# EAGLE design attiny4 (EAGLE 7.2.0)
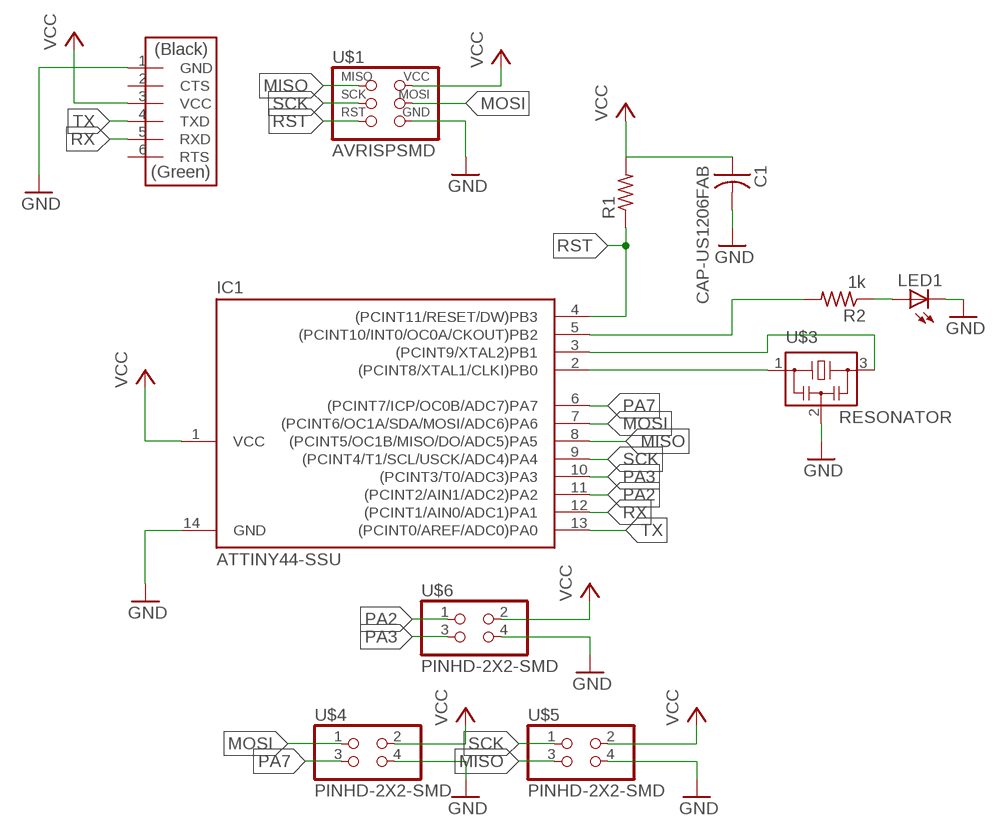
[diagram p0: schematic, sheet 1]

## Parts
C1  CAP-US1206FAB  [C1206FAB]
IC1  ATTINY44-SSU  [SOIC14]
LED1  LEDSML1206  [SML1206]
R1  RES-US1206FAB  [R1206FAB]
R2  1k  RES-US1206FAB  [R1206FAB]
U$1  AVRISPSMD  [2X03SMD]
U$2  FTDI-SMD-HEADER  [1X06SMD]
U$3  RESONATOR  [EFOBM]
U$4  PINHD-2X2-SMD  [2X02SMD]
U$5  PINHD-2X2-SMD  [2X02SMD]
U$6  PINHD-2X2-SMD  [2X02SMD]

## Nets
GND: C1.2 IC1.14(GND) LED1.C U$1.6(GND) U$2.1(GND) U$3.2 U$4.4 U$5.4 U$6.4
MISO: IC1.8((PCINT5/OC1B/MISO/DO/ADC5)PA5) U$1.1(MISO) U$5.3
MOSI: IC1.7((PCINT6/OC1A/SDA/MOSI/ADC6)PA6) U$1.4(MOSI) U$4.1
N$1: LED1.A R2.1
N$15: IC1.3((PCINT9/XTAL2)PB1) U$3.3
N$16: IC1.2((PCINT8/XTAL1/CLKI)PB0) U$3.1
PA2: IC1.11((PCINT2/AIN1/ADC2)PA2) U$6.1
PA3: IC1.10((PCINT3/T0/ADC3)PA3) U$6.3
PA7: IC1.6((PCINT7/ICP/OC0B/ADC7)PA7) U$4.3
PB2: IC1.5((PCINT10/INT0/OC0A/CKOUT)PB2) R2.2
RST: IC1.4((PCINT11/RESET/DW)PB3) R1.1 U$1.5(RST)
RX: IC1.12((PCINT1/AIN0/ADC1)PA1) U$2.5(RXD)
SCK: IC1.9((PCINT4/T1/SCL/USCK/ADC4)PA4) U$1.3(SCK) U$5.1
TX: IC1.13((PCINT0/AREF/ADC0)PA0) U$2.4(TXD)
VCC: C1.1 IC1.1(VCC) R1.2 U$1.2(VCC) U$2.3(VCC) U$4.2 U$5.2 U$6.2
Unconnected: U$2.2(CTS) U$2.6(RTS)

## Library data of the parts
C1 = fab:CAP-US
IC1 = fab:ATTINY44
LED1 = led:LED: LED OSRAM: - CHIPLED LG R971, LG N971, LY N971, LG Q971, LY Q971, LO R971, LY R971 LH N974, LH R974 LS Q976, LO Q976, LY Q976 LO Q996 - Hyper CHIPLED LW Q18S LB Q993, LB Q99A, LB R99A - SideLED LS A670, LO A670, LY A670, LG A670, LP A670 LB A673, LV A673, LT A673, LW A673 LH A674 LY A675 LS A676, LA A676, LO A676, LY A676, LW A676 LS A679, LY A679, LG A679 - Hyper Micro SIDELED® LS Y876, LA Y876, LO Y876, LY Y876 LT Y87S - SmartLED LW L88C, LW L88S LB L89C, LB L89S, LG L890 LS L89K, LO L89K, LY L89K LS L896, LA L896, LO L896, LY L896 - TOPLED LS T670, LO T670, LY T670, LG T670, LP T670 LSG T670, LSP T670, LSY T670, LOP T670, LYG T670 LG T671, LOG T671, LSG T671 LB T673, LV T673, LT T673, LW T673 LH T674 LS T676, LA T676, LO T676, LY T676, LB T676, LH T676, LSB T676, LW T676 LB T67C, LV T67C, LT T67C, LS T67K, LO T67K, LY T67K, LW E67C LS E67B, LA E67B, LO E67B, LY E67B, LB E67C, LV E67C, LT E67C LW T67C LS T679, LY T679, LG T679 LS T770, LO T770, LY T770, LG T770, LP T770 LB T773, LV T773, LT T773, LW T773 LH T774 LS E675, LA E675, LY E675, LS T675 LS T776, LA T776, LO T776, LY T776, LB T776 LHGB T686 LT T68C, LB T68C - Hyper Mini TOPLED® LB M676 - Mini TOPLED Santana® LG M470 LS M47K, LO M47K, LY M47K Source: http://www.osram.convergy.de LUXEON: - LUMILED® LXK2-PW12-R00, LXK2-PW12-S00, LXK2-PW14-U00, LXK2-PW14-V00 LXK2-PM12-R00, LXK2-PM12-S00, LXK2-PM14-U00 LXK2-PE12-Q00, LXK2-PE12-R00, LXK2-PE12-S00, LXK2-PE14-T00, LXK2-PE14-U00 LXK2-PB12-K00, LXK2-PB12-L00, LXK2-PB12-M00, LXK2-PB14-N00, LXK2-PB14-P00, LXK2-PB14-Q00 LXK2-PR12-L00, LXK2-PR12-M00, LXK2-PR14-Q00, LXK2-PR14-R00 LXK2-PD12-Q00, LXK2-PD12-R00, LXK2-PD12-S00 LXK2-PH12-R00, LXK2-PH12-S00 LXK2-PL12-P00, LXK2-PL12-Q00, LXK2-PL12-R00 Source: www.luxeon.com KINGBRIGHT: KA-3528ASYC Source: www.kingbright.com
R1 R2 = fab:RES-US: Resistor (US Symbol) Variants with postfix FAB are widened to allow the routing of internal traces
U$1 = fab:AVRISP
U$2 = fab:FTDI-SMD-HEADER
U$3 = fab:RESONATOR
U$4-U$6 = fab:PINHD-2X2-SMD

## Net classes
0 default: clearance 0.205 mm

## Board
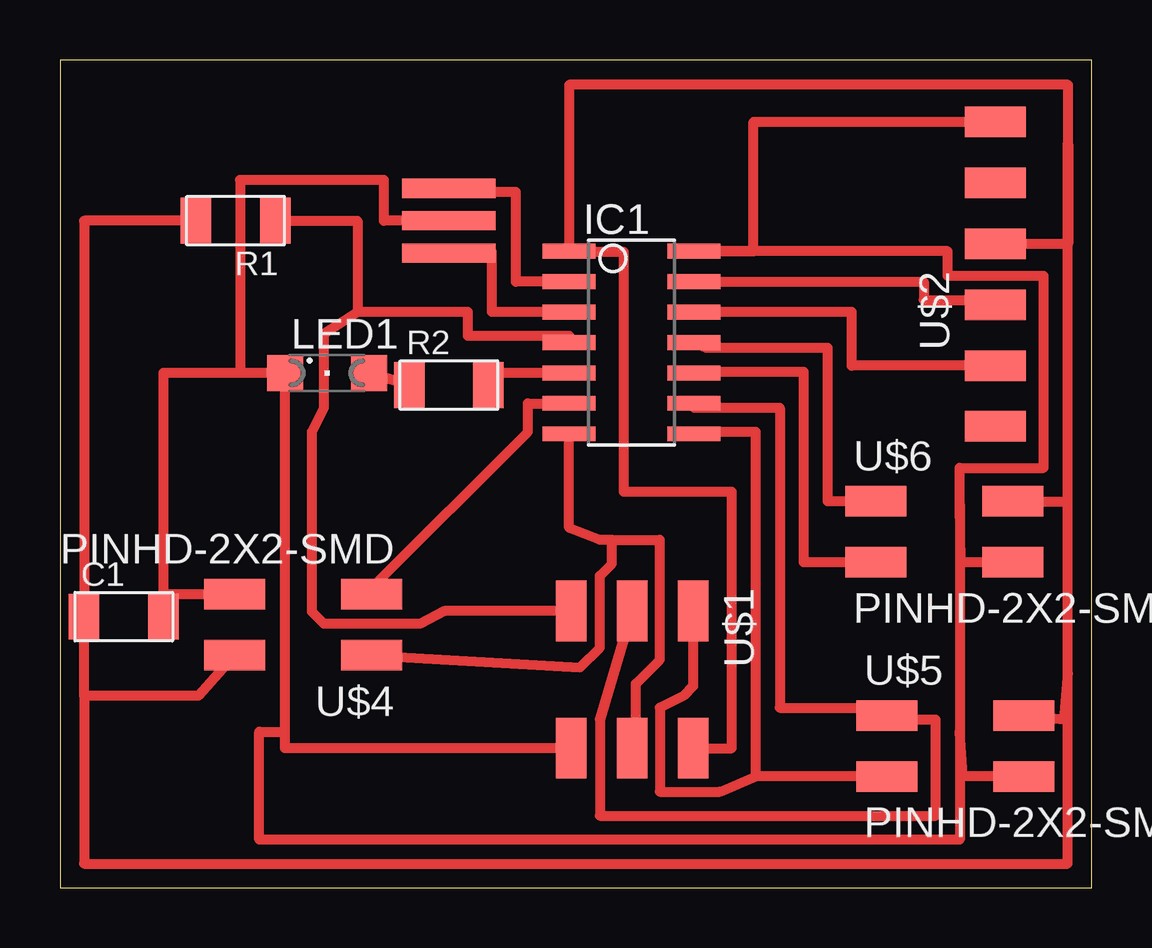
[diagram p1: board, top side]

Size 43 x 34.5 mm. Coordinates in mm from the lower left corner, seen from the top.
Outline: 0,0 43,0 43,34.5 0,34.5 0,0
Copper layers (1*16): Top 0.035mm / dielectric 1.5mm / Bottom 0.035mm
Design rules "default": minimum track width 10mil, minimum drill 24mil, track to track 8mil, track to pad 8mil, pad to pad 8mil, via to via 8mil, smd to smd 8mil, copper to edge 40mil, drill to drill 8mil, minimum pad ring 10mil, minimum via ring 8mil, stop-mask expansion 4mil, vias tented up to drill 0mil, thermal gap 10mil

### Footprints (pad centres in the part's own frame; a part is rotated, then mirrored left to right if it is on the bottom)
C1206FAB = smd 1.27 x 1.905: 1 -1.651,0; 2 1.651,0
SOIC14 = smd 0.61 x 2.21: 1 -3.81,-2.603; 2 -2.54,-2.603; 3 -1.27,-2.603; 4 0,-2.603; 5 1.27,-2.603; 6 2.54,-2.603; 7 3.81,-2.603; 8 3.81,2.603; 9 2.54,2.603; 10 1.27,2.603; 11 0,2.603; 12 -1.27,2.603; 13 -2.54,2.603; 14 -3.81,2.603
SML1206 = smd 1.5 x 1.5: A 1.75,0; C -1.75,0
R1206FAB = smd 1.27 x 1.905: 1 -1.651,0; 2 1.651,0
2X03SMD = smd 2.54 x 1.27: 1 -2.857,2.54; 2 2.857,2.54; 3 -2.857,0; 4 2.857,0; 5 -2.857,-2.54; 6 2.857,-2.54
1X06SMD = smd 2.54 x 1.27: 1 0,6.35; 2 0,3.81; 3 0,1.27; 4 0,-1.27; 5 0,-3.81; 6 0,-6.35
EFOBM = smd 0.8 x 3.9: 1 -1.35,0; 2 0,0; 3 1.35,0
2X02SMD = smd 2.54 x 1.27: 1 -2.857,1.27; 2 2.857,1.27; 3 -2.857,-1.27; 4 2.857,-1.27

### Placement (x,y rotation side)
C1  2.66,11.29 0 top
IC1  23.83,22.72 270 top
LED1  11.13,21.45 0 top
R1  7.32,27.8 180 top
R2  16.21,20.95 0 top
U$1  23.85,8.67 270 top
U$2  38.99,25.57 0 top
U$3  16.21,27.8 270 top
U$4  10.13,10.95 180 top
U$5  37.32,5.9 0 top
U$6  36.87,14.83 0 top

### Tracks (layer width: path | path; a pad name or v marks a point on that pad's centre or on a via)
GND
  Top 0.406: U$2.1 28.91,31.92 28.91,26.53 IC1.14 37,26.53 37,25.5 41,25.5 41,17.5 37.5,17.5 37.5,16 | U$1.6 9.38,5.81 9.38,6.5 | 9.38,6.5 LED1.C 7.5,21.45 | 7.5,21.45 4.31,21.45 4.31,12.22 | 4.31,12.22 C1.2 | U$3.2 13.5,27.8 13.5,29.5 7.5,29.5 7.5,21.45 | 37.5,16 37.5,6.5 | 37.5,6.5 37.5,2 8.31,2 8.31,6.5 9.38,6.5 | U$6.4 37.56,13.56 37.5,16 | U$5.4 37.63,4.63 37.5,6.5 | U$4.4 4.31,12.22
MISO
  Top 0.406: U$1.1 26.39,8.39 26,8 25,7.5 25,4 27.5,4 29,4.63 | 29,4.63 29,19 26.43,19 IC1.8 | U$5.3 29,4.63
MOSI
  Top 0.406: U$1.4 24,5.81 24,8.5 25,9.5 25,14.5 23,14.5 | 23,14.5 22.5,14.5 21.23,15 IC1.7 | U$4.1 21.68,9.18 22.5,10 22.5,13 23,13.5 23,14.5
N$1
  Top 0.406: R2.1 LED1.A
N$15
  Top 0.406: IC1.3 18,23.99 18,26.5 16.21,26.5 U$3.3
N$16
  Top 0.406: IC1.2 19,25.26 19,29 16.21,29 U$3.1
PA2
  Top 0.406: U$6.1 32,16.1 32,22.5 26.93,22.5 IC1.11
PA3
  Top 0.406: U$6.3 31,13.56 31,21.5 26.43,21.5 IC1.10
PA7
  Top 0.406: U$4.3 12.99,12.49 19.5,19 19.5,20.18 IC1.6
PB2
  Top 0.406: IC1.5 17.86,21.45 R2.2
RST
  Top 0.406: R1.1 12.4,27.8 12.4,24 | IC1.4 21.23,23 17,23 17,24 12.4,24 | U$1.5 16.03,11.53 15,11 11,11 10.5,11.5 10.5,19 11,20 11,23.09 12.4,23.99 12.4,24
RX
  Top 0.406: IC1.12 31.45,23.99 31.45,24 33,24 33,21.76 U$2.5
SCK
  Top 0.406: U$1.3 22.5,7.03 22.5,3 36.5,3 36.5,7 34.5,7 | IC1.9 26.43,20 30,20 30,7.5 34.5,7.5 34.5,7 | 34.5,7 34.46,7.5 U$5.1
TX
  Top 0.406: IC1.13 36,25.26 36,24.5 38.99,24.5 U$2.4
VCC
  Top 0.406: U$2.3 42.03,26.84 42.03,31 | 42.03,31 42.03,33.46 21.23,33.46 IC1.1 21.23,26.5 23.5,26.5 23.5,16.5 28,16.5 28,5.81 U$1.2 | R1.2 1,27.8 1,11.5 1.01,11.5 C1.1 1.01,8 | 42,9 42,1 1,1 1,8 1.01,8 | 42,9 42,16.1 | 42,16.1 42,31 42.03,31 | U$6.2 42,16.1 | 42,9 41.85,7 U$5.2 | U$4.2 5.77,8 1.01,8